# Altium project controlled rectifier.PrjPCB
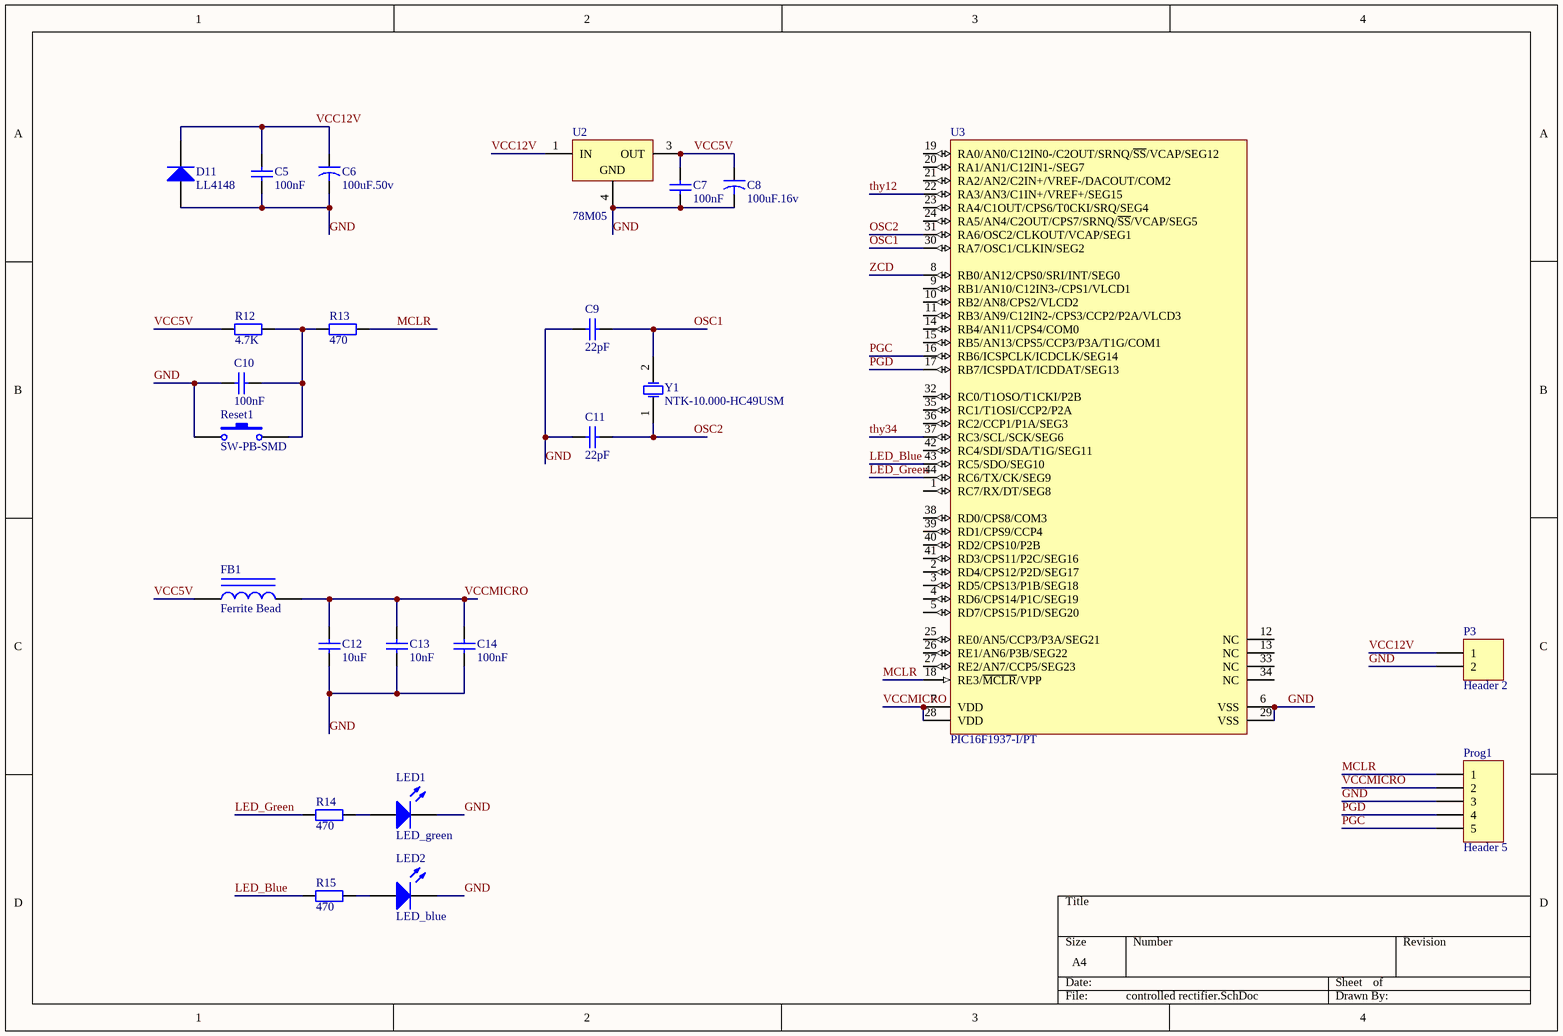
[diagram p0: controlled rectifier.SchDoc]
2 sheets, 64 parts. Net scope: global (net labels, ports and power ports of the same name join across sheets).
Board file: Controlled Rectifier.PcbDoc
Sheets:
  controlled rectifier.SchDoc
  controlled rectifier2.SchDoc

## Sheet controlled rectifier.SchDoc
size A4

### Parts
C5  100nF  [CAPS_0805]
C6  100uF.50v  [CAP_ELEC_SIZE_G]
C7  100nF  [CAPS_0805]
C8  100uF.16v  [CAP_ELEC_6.3x4.2]
C9  22pF  [CAPS_0805]
C10  100nF  [CAPS_0805]
C11  22pF  [CAPS_0805]
C12  10uF  [CAPS_0805]
C13  10nF  [CAPS_0805]
C14  100nF  [CAPS_0805]
D11  LL4148  [SOD80, LL-34]
FB1  Ferrite Bead  [FBC2012N]
LED1  LED_green  [LED-0805-A]
LED2  LED_blue  [LED-0805-A]
P3  Header 2  [Phoenix 2 Pin -RA]
Prog1  Header 5  [SH-5 Pin]
R12  4.7K  [RES_0805]
R13  470  [RES_0805]
R14  470  [RES_0805]
R15  470  [RES_0805]
Reset1  SW-PB-SMD  [KFC-6X6X4.5-4P-SMD]
U2  78M05  [TO-252]
U3  PIC16F1937-I/PT  [TQFP-PT44_N]
Y1  NTK-10.000-HC49USM  [XTLT_2]

### Nets
GND: C5.1 C6.2 C7.1 C8.2 C9.1 C10.2 C11.1 C12.1 C13.1 C14.1 D11.1(A) LED1.2(K) LED2.2(K) P3.2 Prog1.3 Reset1.1 U2.4(GND) U3.6(VSS) U3.29(VSS)
LED_Blue: R15.1 U3.43(RC5/SDO/SEG10)
LED_Green: R14.1 U3.44(RC6/TX/CK/SEG9)
MCLR: Prog1.1 R13.2 U3.18(RE3/~{MCLR}/VPP)
OSC1: C9.2 U3.30(RA7/OSC1/CLKIN/SEG2) Y1.2(OSC2)
OSC2: C11.2 U3.31(RA6/OSC2/CLKOUT/VCAP/SEG1) Y1.1(OSC1)
PGC: Prog1.5 U3.16(RB6/ICSPCLK/ICDCLK/SEG14)
PGD: Prog1.4 U3.17(RB7/ICSPDAT/ICDDAT/SEG13)
thy12: U3.22(RA3/AN3/C1IN+/VREF+/SEG15)
thy34: U3.37(RC3/SCL/SCK/SEG6)
VCC5V: C7.2 C8.1 FB1.1 R12.1 U2.3(OUT)
VCC12V: C5.2 C6.1 D11.2(K) P3.1 U2.1(IN)
VCCMICRO: C12.2 C13.2 C14.2 FB1.2 Prog1.2 U3.7(VDD) U3.28(VDD)
ZCD: U3.8(RB0/AN12/CPS0/SRI/INT/SEG0)
NetC10_1: C10.1 R12.2 R13.1 Reset1.2
NetLED1_1: LED1.1(A) R14.2
NetLED2_1: LED2.1(A) R15.2

Not connected (* = marked no-connect by the designer): U3 1(RC7/RX/DT/SEG8) 2(RD4/CPS12/P2D/SEG17) 3(RD5/CPS13/P1B/SEG18) 4(RD6/CPS14/P1C/SEG19) 5(RD7/CPS15/P1D/SEG20) 9(RB1/AN10/C12IN3-/CPS1/VLCD1) 10(RB2/AN8/CPS2/VLCD2) 11(RB3/AN9/C12IN2-/CPS3/CCP2/P2A/VLCD3) 12(NC) 13(NC) 14(RB4/AN11/CPS4/COM0) 15(RB5/AN13/CPS5/CCP3/P3A/T1G/COM1) 19(RA0/AN0/C12IN0-/C2OUT/SRNQ/~{SS}/VCAP/SEG12) 20(RA1/AN1/C12IN1-/SEG7) 21(RA2/AN2/C2IN+/VREF-/DACOUT/COM2) 23(RA4/C1OUT/CPS6/T0CKI/SRQ/SEG4) 24(RA5/AN4/C2OUT/CPS7/SRNQ/~{SS}/VCAP/SEG5) 25(RE0/AN5/CCP3/P3A/SEG21) 26(RE1/AN6/P3B/SEG22) 27(RE2/AN7/CCP5/SEG23) 32(RC0/T1OSO/T1CKI/P2B) 33(NC) 34(NC) 35(RC1/T1OSI/CCP2/P2A) 36(RC2/CCP1/P1A/SEG3) 38(RD0/CPS8/COM3) 39(RD1/CPS9/CCP4) 40(RD2/CPS10/P2B) 41(RD3/CPS11/P2C/SEG16) 42(RC4/SDI/SDA/T1G/SEG11)

### Library data of the parts
C5 C7 = CAP SMD 0805: CAP 0805; Designer: Abbas Basereh; Desc.: CAP SMD 0805; Data: 16-12-2016
C6 C8 = Cap2: Capacitor; Value: 100pF; Published: 23-Sep-2002; PackageReference: CAPR5-4X5; Publisher: Altium Limited; PackageDescription: Capacitor; 2 Leads
C9 C11-C14 = Cap: Capacitor; Value: 0.1uF; Published: 8-Jun-2000; LatestRevisionDate: 17-Jul-2002; LatestRevisionNote: Re-released for DXP Platform.; PackageReference: RAD-0.3; Publisher: Altium Limited; PackageDescription: Radial Cap, Thru-Hole; 2 Leads; 0.3 in Pin Spacing
C10 = Cap: Capacitor; Published: 8-Jun-2000; LatestRevisionDate: 17-Jul-2002; LatestRevisionNote: Re-released for DXP Platform.; PackageReference: RAD-0.3; Publisher: Altium Limited; PackageDescription: Radial Cap, Thru-Hole; 2 Leads; 0.3 in Pin Spacing; Value: 100nF
D11 = Diode: Default Diode; Published: 8-Jun-2000; LatestRevisionDate: 17-Jul-2002; LatestRevisionNote: Re-released for DXP Platform.; PackageVersion: Sep-1996; PackageReference: SMC; Publisher: Altium Limited; PackageDescription: DO-214-AB/SMC; 2 C-Bend Leads; Body 7.9 x 5.9 mm, inc. leads (LxW); Code_JEDEC: DO-214-AB
FB1 = Inductor Iron: Magnetic-Core Inductor; Value: 10mH; Published: 24-Mar-1999; LatestRevisionDate: 17-Jul-2002; LatestRevisionNote: Re-released for DXP Platform.; PackageReference: AXIAL-0.9; Publisher: Altium Limited; PackageDescription: Axial Device, Thru-Hole; 2 Leads; 0.9 in Pin Spacing
LED1 LED2 = LED2: Typical RED, GREEN, YELLOW, AMBER GaAs LED; Published: 8-Jun-2000; LatestRevisionDate: 17-Jul-2002; LatestRevisionNote: Re-released for DXP Platform.; PackageVersion: Feb-2002; PackageReference: 3.2X1.6X1.1; Publisher: Altium Limited; PackageDescription: SM LED; 2 Flat Leads
P3 = Header 2: Header, 2-Pin; LatestRevisionDate: 17-Jul-2002; LatestRevisionNote: Re-released for DXP Platform.; Publisher: Altium Limited
Prog1 = Header 5: Header, 5-Pin; LatestRevisionDate: 17-Jul-2002; LatestRevisionNote: Re-released for DXP Platform.; Publisher: Altium Limited
R12 R13 = Res2: Resistor; Published: 8-Jun-2000; LatestRevisionDate: 17-Jul-2002; LatestRevisionNote: Re-released for DXP Platform.; PackageReference: AXIAL-0.4; Publisher: Altium Limited; PackageDescription: Axial Device, Thru-Hole; 2 Leads; 0.4 in Pin Spacing
  R12: Value: 4.7K
  R13: Value: 470
R14 R15 = Res2: Resistor; Value: 220; Published: 8-Jun-2000; LatestRevisionDate: 17-Jul-2002; LatestRevisionNote: Re-released for DXP Platform.; PackageReference: AXIAL-0.4; Publisher: Altium Limited; PackageDescription: Axial Device, Thru-Hole; 2 Leads; 0.4 in Pin Spacing
Reset1 = SW-PB: Switch; Published: 24-Mar-1999; LatestRevisionDate: 17-Jul-2002; LatestRevisionNote: Re-released for DXP Platform.; PackageReference: SPST-2; Publisher: Altium Limited; PackageDescription: Switch; 2 Leads
U2 = µA78M05CKTPR: Positive-Voltage Regulator; Note: Pin 2 is electrically connected to pin4, and not drawn.; Published: 15-Apr-2002; DatasheetVersion: Jul-1999; PackageVersion: Jan-2001; PackageReference: KTP02; Publisher: Altium Limited; PackageDescription: PowerFLEX (D-PAK/TO-252-AA); 3 Leads (1 Cropped); Body 9.7 (inc. leads) x 6.2 mm (LxW max); Code_JEDEC: TO-252; ComponentLink1Description: Manufacturer Link; ComponentLink1URL: http://www.ti.com/; ComponentLink2Description: Datasheet; ComponentLink2URL: http://www-s.ti.com/sc/ds/ua78m05.pdf
U3 = PIC16F1937-I/PT: CMOS Microcontroller with LCD Driver, 8K (words) Program Memory, 256 Bytes Data Memory, 512 Bytes SRAM, 36 I/O's, 1.8V-5.5V, 44-Pin TQFP, Industrial Temperature, Tray; Manufacturer: Microchip; DatasheetVersion: revE, May-2011; PackageVersion: revBB, Aug-2009; PackageReference: TQFP-PT44; PackageDescription: 44-Lead Plastic Thin Quad Flatpack (PT) - 10x10x1mm Body, 2.00mm [TQFP]; Supplier 1: Digi-Key; Supplier Part Number 1: PIC16F1937-I/PT-ND; Supplier 2: Farnell; Supplier Part Number 2: 1755826; Supplier 3: Farnell; Supplier Part Number 3: 1755826MPKG; Supplier 4: Newark; Supplier Part Number 4: 45P4775; Supplier 5: Mouser; Supplier Part Number 5: 579-PIC16F1937-I/PT; Code_JEDEC: MS-026; PartNumber: PIC16F1937-I/PT; ComponentLink1Description: Manufacturer URL; ComponentLink1URL: http://www.microchip.com/; ComponentLink2Description: Datasheet; ComponentLink2URL: http://ww1.microchip.com/downloads/en/DeviceDoc/41364E.pdf
Y1 = XTAL: Crystal Oscillator; Published: 8-Jun-2000; LatestRevisionDate: 17-Jul-2002; LatestRevisionNote: Re-released for DXP Platform.; PackageReference: R38; Publisher: Altium Limited; PackageDescription: Crystal, Thru-Hole; 2 Leads; Body 3.1 x 8.2 mm (Dia.xH)

## Sheet controlled rectifier2.SchDoc
size A4
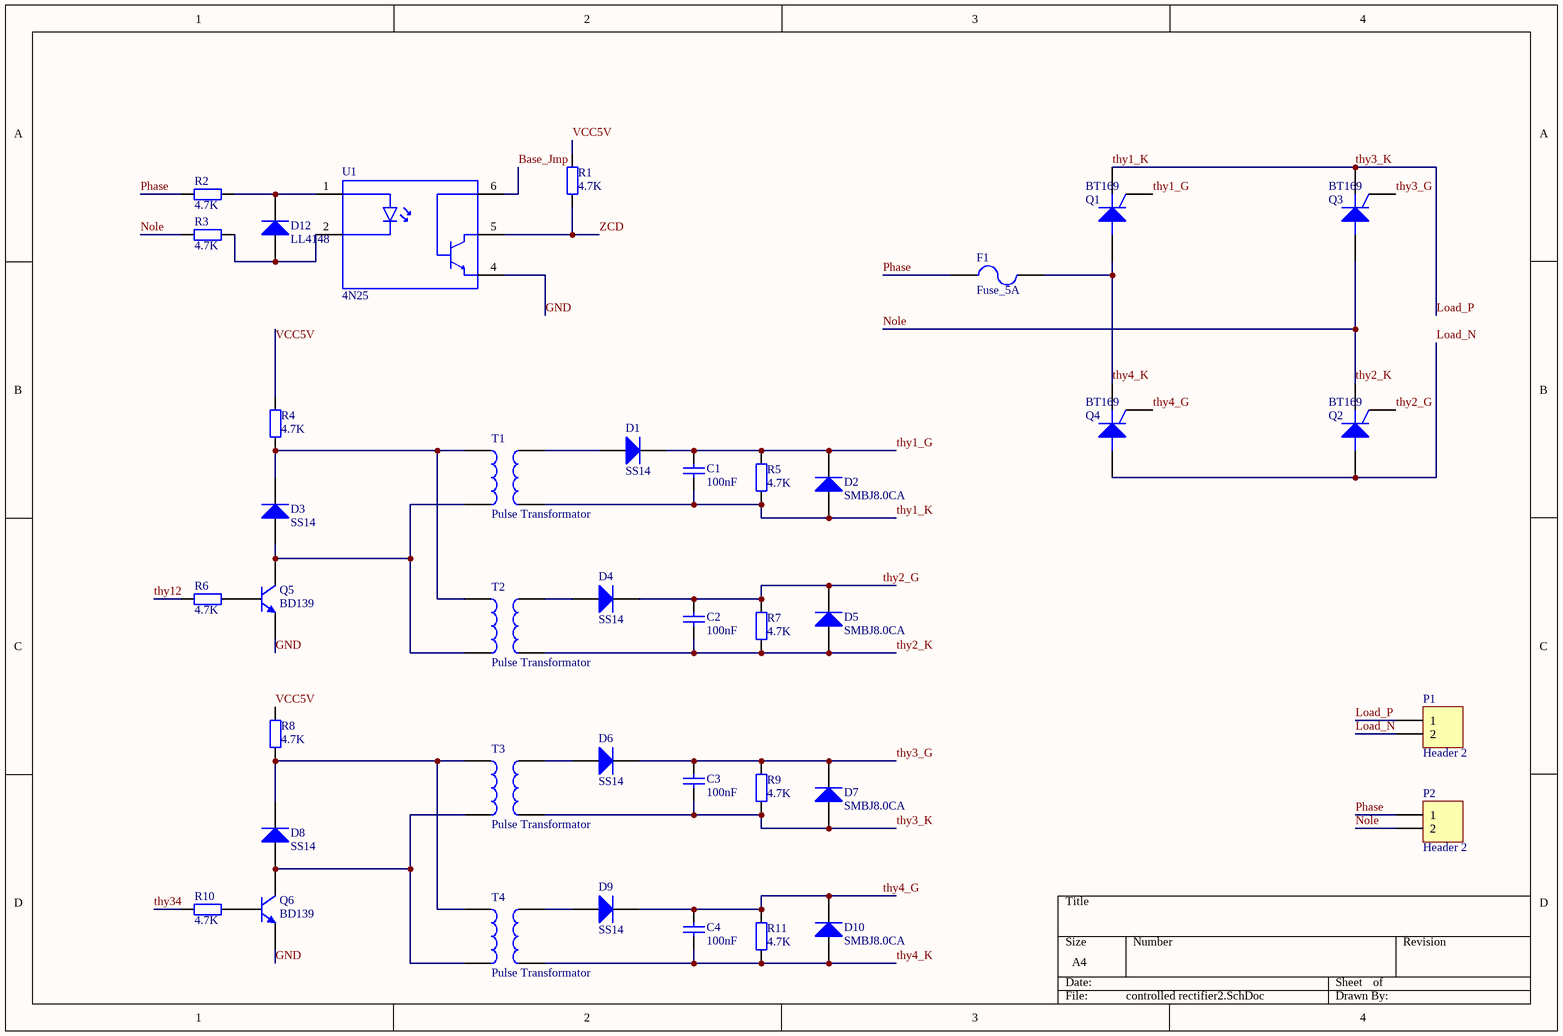
[diagram p1: controlled rectifier2.SchDoc]

### Parts
C1  100nF  [CAPS_0805]
C2  100nF  [CAPS_0805]
C3  100nF  [CAPS_0805]
C4  100nF  [CAPS_0805]
D1  SS14  [DO-214AC]
D2  SMBJ8.0CA  [SMC]
D3  SS14  [DO-214AC]
D4  SS14  [DO-214AC]
D5  SMBJ8.0CA  [SMC]
D6  SS14  [DO-214AC]
D7  SMBJ8.0CA  [SMC]
D8  SS14  [DO-214AC]
D9  SS14  [DO-214AC]
D10  SMBJ8.0CA  [SMC]
D12  LL4148  [SOD80, LL-34]
F1  Fuse_5A  [fuse-2]
P1  Header 2  [Phoenix 2 Pin -RA]
P2  Header 2  [Phoenix 2 Pin -RA]
Q1  BT169  [BT169]
Q2  BT169  [BT169]
Q3  BT169  [BT169]
Q4  BT169  [BT169]
Q5  BD139  [BD139]
Q6  BD139  [BD139]
R1  4.7K  [res_0805]
R2  4.7K  [res_0805]
R3  4.7K  [res_0805]
R4  4.7K  [res_0805]
R5  4.7K  [res_0805]
R6  4.7K  [res_0805]
R7  4.7K  [res_0805]
R8  4.7K  [res_0805]
R9  4.7K  [res_0805]
R10  4.7K  [res_0805]
R11  4.7K  [res_0805]
T1  Pulse Transformator  [Pulse Trans_Small]
T2  Pulse Transformator  [Pulse Trans_Small]
T3  Pulse Transformator  [Pulse Trans_Small]
T4  Pulse Transformator  [Pulse Trans_Small]
U1  4N25  [DIP762W50P254L712H400Q6N]

### Nets
Base_Jmp: U1.6(B)
GND: Q5.3(E) Q6.3(E) U1.4(E)
Load_N: P1.2 Q2.1(A) Q4.1(A)
Load_P: C1.1 C3.1 D2.1(A) D7.1(A) P1.1 Q1.3(K) Q3.3(K) R5.1 R9.1 T1.4 T3.4  [also labelled thy1_K, thy3_K]
Nole: C2.1 D5.1(A) P2.2 Q2.3(K) Q3.1(A) R3.1 R7.1 T2.4  [also labelled thy2_K]
Phase: F1.1 P2.1 R2.1
thy1_G: C1.2 D1.2(K) D2.2(K) Q1.2(G) R5.2
thy2_G: C2.2 D4.2(K) D5.2(K) Q2.2(G) R7.2
thy3_G: C3.2 D6.2(K) D7.2(K) Q3.2(G) R9.2
thy4_G: C4.2 D9.2(K) D10.2(K) Q4.2(G) R11.2
thy4_K: C4.1 D10.1(A) F1.2 Q1.1(A) Q4.3(K) R11.1 T4.4
thy12: R6.1
thy34: R10.1
VCC5V: R1.2 R4.2 R8.2
ZCD: R1.1 U1.5(C)
NetD1_1: D1.1(A) T1.3
NetD3_1: D3.1(A) Q5.1(C) T1.2 T2.2
NetD3_2: D3.2(K) R4.1 T1.1 T2.1
NetD4_1: D4.1(A) T2.3
NetD6_1: D6.1(A) T3.3
NetD8_1: D8.1(A) Q6.1(C) T3.2 T4.2
NetD8_2: D8.2(K) R8.1 T3.1 T4.1
NetD9_1: D9.1(A) T4.3
NetD12_1: D12.1(A) R3.2 U1.2(K)
NetD12_2: D12.2(K) R2.2 U1.1(A)
NetQ5_2: Q5.2(B) R6.2
NetQ6_2: Q6.2(B) R10.2

### Library data of the parts
C1-C4 = CAP SMD 0805: CAP 0805; Designer: Abbas Basereh; Desc.: CAP SMD 0805; Data: 16-12-2016
D1-D10 D12 = Diode: Default Diode; Published: 8-Jun-2000; LatestRevisionDate: 17-Jul-2002; LatestRevisionNote: Re-released for DXP Platform.; PackageVersion: Sep-1996; PackageReference: SMC; Publisher: Altium Limited; PackageDescription: DO-214-AB/SMC; 2 C-Bend Leads; Body 7.9 x 5.9 mm, inc. leads (LxW); Code_JEDEC: DO-214-AB
F1 = Fuse 2: Fuse; Published: 8-Jun-2000; LatestRevisionDate: 17-Jul-2002; LatestRevisionNote: Re-released for DXP Platform.; PackageReference: PIN-W2/E2.8; Publisher: Altium Limited; PackageDescription: Thru-Hole; 2 Leads
P1 P2 = Header 2: Header, 2-Pin; LatestRevisionDate: 17-Jul-2002; LatestRevisionNote: Re-released for DXP Platform.; Publisher: Altium Limited
Q1-Q4 = SCR: Silicon Controlled Rectifier; Published: 8-Jun-2000; LatestRevisionDate: 17-Jul-2002; LatestRevisionNote: Re-released for DXP Platform.; PackageReference: TO-220-AB; Publisher: Altium Limited; Code_JEDEC: TO-220-AB
Q5 Q6 = NPN: NPN Bipolar Transistor; Published: 8-Jun-2000; LatestRevisionDate: 17-Jul-2002; LatestRevisionNote: Re-released for DXP Platform.; PackageReference: TO-226-AA; Publisher: Altium Limited; PackageDescription: TO, Flat Index; 3 In-Line, Axial Leads; Body Dia. 4.8mm; Leads 0.55 x 0.51 mm (max); Code_JEDEC: TO-226-AA
R1-R11 = Res2: Resistor; Published: 8-Jun-2000; LatestRevisionDate: 17-Jul-2002; LatestRevisionNote: Re-released for DXP Platform.; PackageReference: AXIAL-0.4; Publisher: Altium Limited; PackageDescription: Axial Device, Thru-Hole; 2 Leads; 0.4 in Pin Spacing; Value: 4.7K
T1-T4 = Trans: Transformer; Published: 24-Mar-1999; LatestRevisionDate: 08-Jul-2005; LatestRevisionNote: Mech Layer 1 removed.; PackageReference: TRANS; Publisher: Altium Limited; PackageDescription: Transformer; 4 Leads
U1 = 4N25: Optoisolator Transistor with Base Output 5000Vrms 1 Channel 6-DIP; MF: Vishay Semiconductor; Package: DIP-6 Lite-On; Value: *; Price: None; MP: 4N25; SnapEDA_Link: https://www.snapeda.com/parts/4N25/Vishay%20Semiconductor%20Opto%20Division/view-part/641454/?ref=snap; Availability: Unavailable

## Nets that join several sheets
GND: controlled rectifier (19 pins), controlled rectifier2 (Q5.3 Q6.3 U1.4)
thy12: controlled rectifier (U3.22), controlled rectifier2 (R6.1)
thy34: controlled rectifier (U3.37), controlled rectifier2 (R10.1)
VCC5V: controlled rectifier (5 pins), controlled rectifier2 (R1.2 R4.2 R8.2)
ZCD: controlled rectifier (U3.8), controlled rectifier2 (R1.1 U1.5)